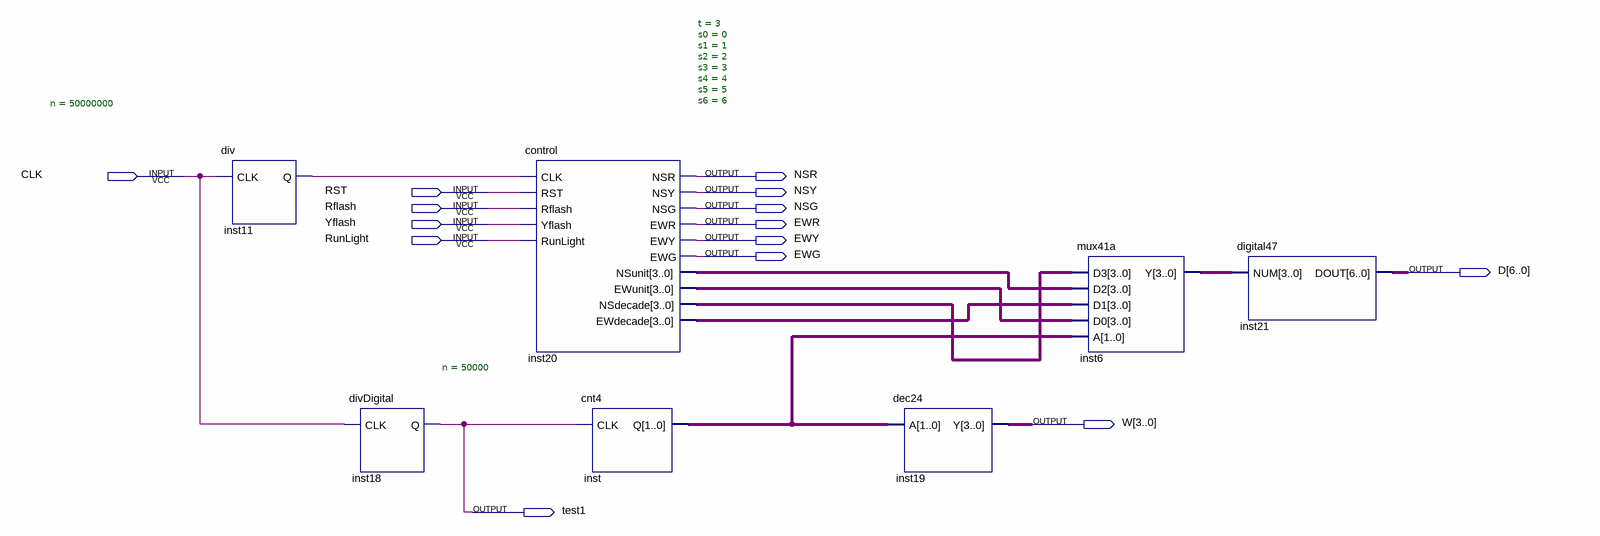
[diagram p0: schematic sheet]
// Quartus schematic fpga.bdf as structural Verilog: 7 symbols, 14 pins
module fpga (
  input  CLK,
  input  RST,
  input  Rflash,
  input  Yflash,
  input  RunLight,
  output NSR,
  output NSY,
  output NSG,
  output EWR,
  output EWY,
  output EWG,
  output [6:0] D,
  output [3:0] W,
  output test1
);

  wire inst11_q;
  wire [1:0] inst_q;
  wire [3:0] inst6_y, inst20_ewdecade, inst20_ewunit, inst20_nsdecade, inst20_nsunit;

  div #(.n(50000000)) inst11 (.CLK(CLK), .Q(inst11_q));
  divDigital #(.n(50000)) inst18 (.CLK(CLK), .Q(test1));
  control #(.t(3), .s0(0), .s1(1), .s2(2), .s3(3), .s4(4), .s5(5), .s6(6)) inst20 (
    .CLK(inst11_q), .RST(RST), .Rflash(Rflash), .Yflash(Yflash), .RunLight(RunLight), .NSR(NSR), .NSY(NSY),
    .NSG(NSG), .EWR(EWR), .EWY(EWY), .EWG(EWG), .NSunit(inst20_nsunit), .EWunit(inst20_ewunit),
    .NSdecade(inst20_nsdecade), .EWdecade(inst20_ewdecade));
  cnt4 inst (.CLK(test1), .Q(inst_q));
  dec24 inst19 (.A(inst_q), .Y(W));
  mux41a inst6 (
    .D3(inst20_nsdecade), .D2(inst20_nsunit), .D1(inst20_ewdecade), .D0(inst20_ewunit), .A(inst_q),
    .Y(inst6_y));
  digital47 inst21 (.NUM(inst6_y), .DOUT(D));
endmodule
